# EasyEDA Pro project ProPrj_100MHz��ѹ���̽ͷ_2024-07-25.epro, board 高压差分探头_PLUS_V6
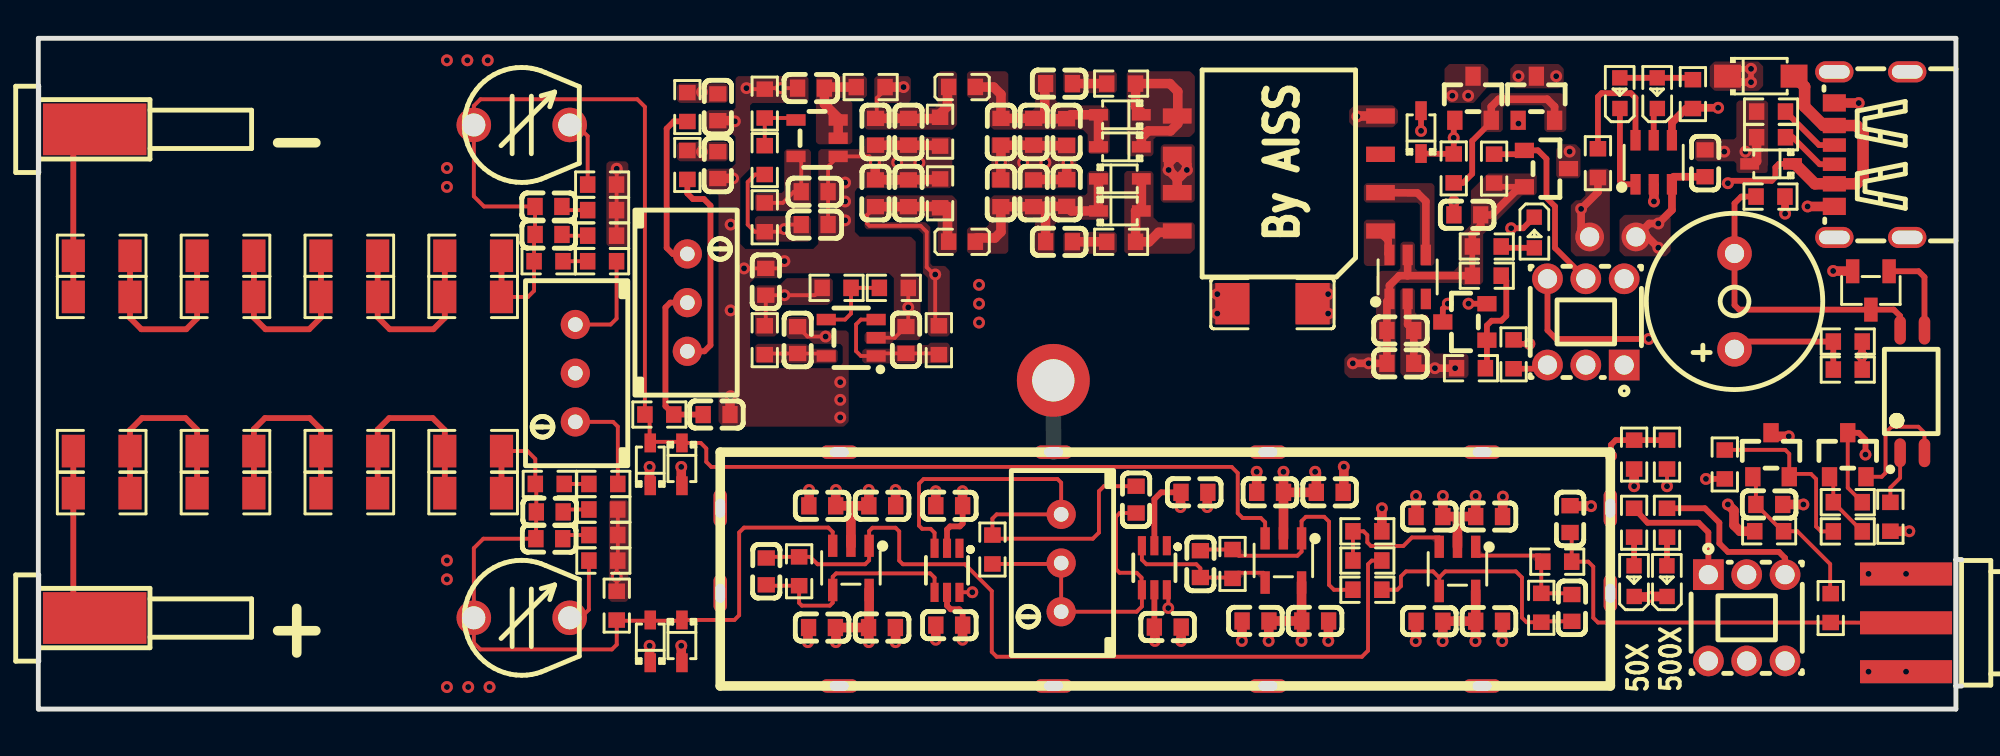
[diagram p6: board, top side]
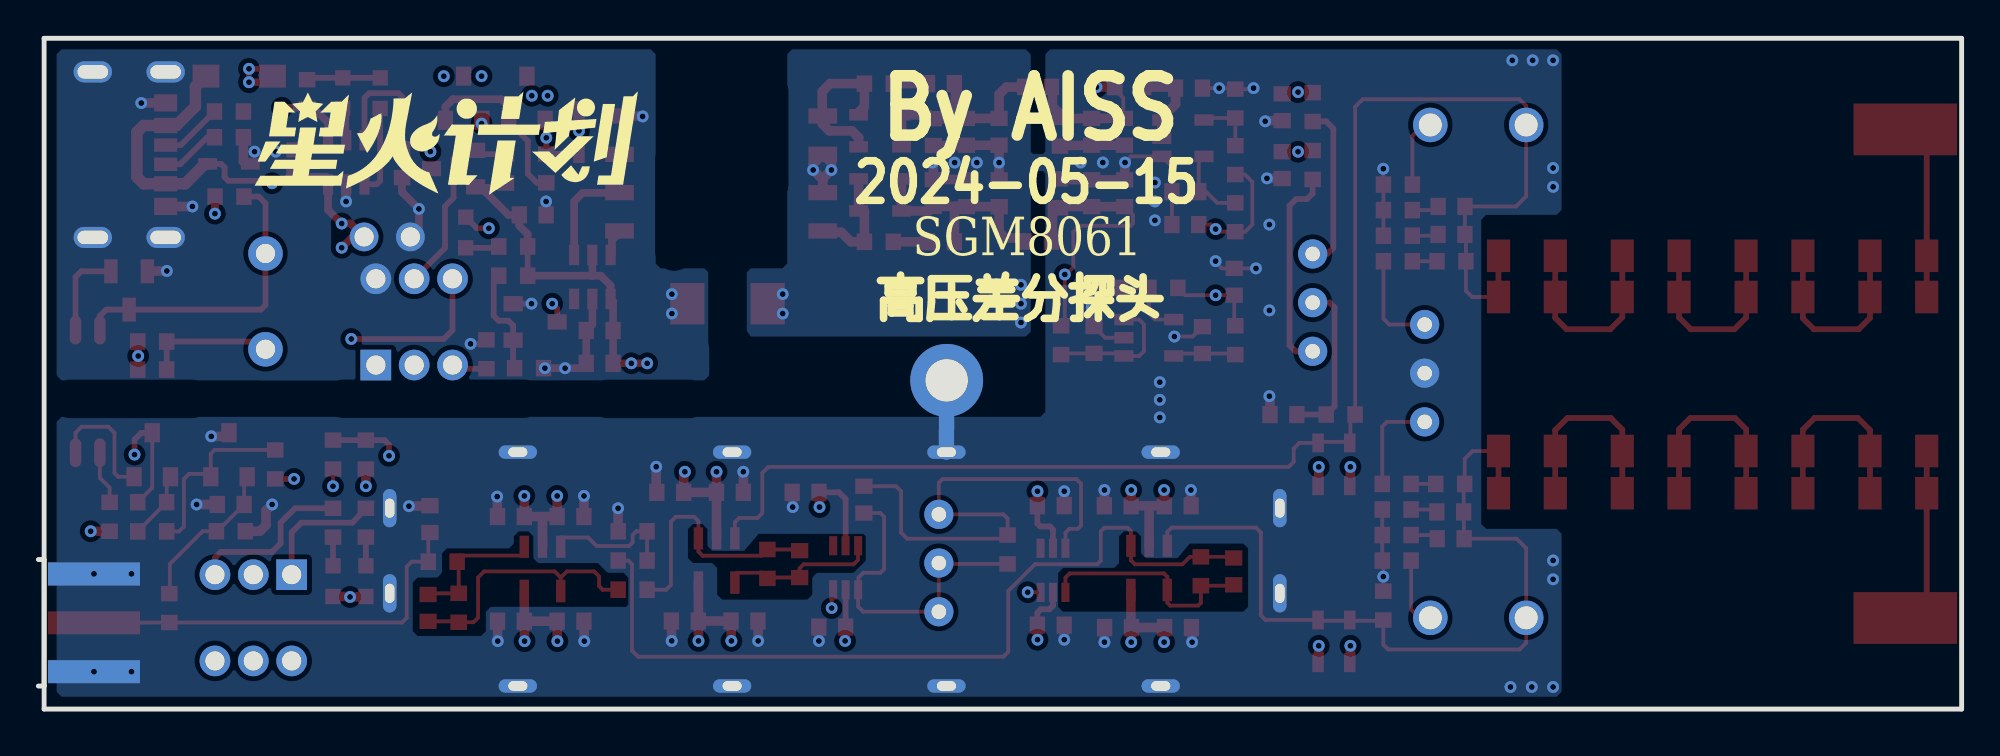
[diagram p7: board, bottom side, seen from below]

Outline 100.3 x 35 mm; copper layers: Top Layer, Inner1, Inner2, Bottom Layer. Coordinates in mm from the lower left corner of the outline.
Outline path: 0,35 100,35 100,0 0,0 0,35
Stack: Top Layer 0.035mm / Dielectric1 0.48mm PP er 4.5 / Inner1 0.035mm / Dielectric2 0.48mm FR4 er 4.5 / Inner2 0.035mm / Dielectric3 0.48mm PP er 4.5 / Bottom Layer 0.035mm

## Design rules (mm)
spacing Default (default): track to track 0.18, other pairs 0 to 0.18
track width Default (default): min 0.1, default 0.1, max 25.4
differential pair differentialPair (default): width min 0.127, default 0.254, max 2.54; gap min 0.152, default 0.152
via Default (default): diameter min 0.61, default 0.61, max 100.025; hole min 0.305, default 0.305, max 59.995

## Placement (name value [footprint] x y rotation side)
BUZZER  3kHz  [BUZ-TH_BD9.0-P5.00-D0.6-FD]  88.46 21.27 90 top
C1  22uF  [C0603]  51.9 26.92 270 top
C2  22uF  [C0603]  50.19 26.92 270 top
C3  1uF  [C0603]  44 4.25 180 top
C4  100nF  [C0603]  53.63 26.93 90 top
C5  22uF  [C0603]  43.66 30.12 90 top
C7  22uF  [C0603]  50.2 30.12 90 top
C8  22uF  [C0603]  51.91 30.12 90 top
C9  100nF  [C0603]  40.87 4.25 180 top
C10  10uF  [C0603]  45.25 19.26 270 top
C11  10uF  [C0603]  39.59 19.25 270 top
C12  10uF  [C0603]  37.94 22.3 270 top
C13  10uF  [C0603]  86.92 28.48 270 top
C14  1nF  [C0603]  53.23 24.38 180 top
C15  10uF  [C0603]  40.29 32.4 0 top
C16  10uF  [C0603]  40.48 27 180 top
C17  10uF  [C0603]  40.48 25.28 180 top
C18  100nF  [C0603]  53.62 30.11 270 top
C19  1nF  [C0603]  53.23 32.64 180 top
C20  10uF  [C0603]  71.03 18.04 180 top
C21  10uF  [C0603]  71.03 19.76 180 top
C22  100nF  [C0603]  35.43 31.4 270 top
C23  100nF  [C0603]  35.43 28.38 270 top
C24  2.2pF  [R1206]  3.3 21.51 180 top
C25  2.2pF  [R1206]  9.76 21.51 180 top
C26  2.2pF  [R1206]  16.22 21.51 180 top
C27  2.2pF  [R1206]  22.67 21.51 180 top
C28  10uF  [C0603]  74.52 25.79 0 top
C29  100nF  [C0603]  35.37 15.37 0 top
C30  68pF  [C0603]  26.61 24.77 180 top
C31  100pF  [C0603]  26.6 26.23 180 top
C32  120pF  [CAP-TH_JML06]  25.21 30.48 0 top
C33  820pF  [C0603]  37.96 7.18 270 top
C34  10pF  [C0603]  57.25 10.93 90 top
C35  2.2pF  [C0603]  79.97 5.28 270 top
C36  220pF  [C0603]  60.6 7.56 270 top
C37  68pF  [C0603]  26.67 10.29 0 top
C38  100pF  [C0603]  26.65 8.89 0 top
C39  120pF  [CAP-TH_JML06]  25.21 4.76 0 top
C40  2.2pF  [R1206]  3.3 13.46 180 top
C41  2.2pF  [R1206]  9.76 13.46 180 top
C42  2.2pF  [R1206]  16.22 13.46 180 top
C43  2.2pF  [R1206]  22.67 13.46 180 top
C44  NC  [C0603]  79.88 9.91 270 top
C45  2.2pF  [C0603]  90.27 10.68 0 top
C46  1uF  [C0603]  63.48 4.6 0 top
C47  1uF  [C0603]  72.55 4.58 0 top
C48  100nF  [C0603]  66.59 4.6 0 top
C49  100nF  [C0603]  75.66 4.58 0 top
C50  100nF  [C0603]  75.66 10.05 0 top
C51  100nF  [C0603]  67.35 11.31 0 top
C52  1uF  [C0603]  72.55 10.05 0 top
C53  1uF  [C0603]  64.24 11.31 0 top
C54  100nF  [C0603]  44.01 10.6 0 top
C55  1uF  [C0603]  40.88 10.6 0 top
C56  100nF  [C0603]  47.5 4.38 180 top
C57  100nF  [C0603]  47.5 10.61 180 top
C59  22uF  [C0603]  45.38 30.12 90 top
C60  22uF  [C0603]  43.65 26.92 270 top
C61  22uF  [C0603]  45.37 26.92 270 top
C62  100nF  [C0603]  58.9 4.28 0 top
C63  100nF  [C0603]  60.29 11.31 0 top
D1  PESD5V0S1BA  [SOD-323_L1.7-W1.3-LS2.5-FD-1]  90.36 28.45 0 top
D2  B0520LW  [SOD-123FL_L2.7-W1.8-LS3.8-RD]  89.82 33.03 0 top
D3  B5819WS  [SOD-323_L1.7-W1.3-LS2.5-FD-1]  56.4 27.66 180 top
D4  B5819WS  [SOD-323_L1.7-W1.3-LS2.5-FD-1]  56.4 25.99 180 top
D5  B5819WS  [SOD-323_L1.7-W1.3-LS2.5-FD-1]  72.11 30.11 270 top
D6  B5819WS  [SOD-323_L1.7-W1.3-LS2.5-FD-1]  56.4 31.01 0 top
D7  B5819WS  [SOD-323_L1.7-W1.3-LS2.5-FD-1]  56.4 29.34 0 top
D8  1N4148WS  [SOD-323_L1.7-W1.3-LS2.5-FD-1]  31.91 12.77 270 top
D9  1N4148WS  [SOD-323_L1.7-W1.3-LS2.5-FD-1]  33.56 12.77 90 top
D10  1N4148WS  [SOD-323_L1.7-W1.3-LS2.5-FD-1]  31.91 3.53 270 top
D11  1N4148WS  [SOD-323_L1.7-W1.3-LS2.5-FD-1]  33.56 3.53 90 top
L1  2KΩ  [L0603]  48.17 24.39 180 top
L2  2KΩ  [L0603]  48.17 32.47 180 top
LED1  BLUE  [LED0603-RD]  83.22 6.67 90 top
LED2  BLUE  [LED0603-RD]  84.93 6.67 90 top
NOREF  -  [Pad_e7178]  75.3 13.41 0 top
NOREF#2  -  [Pad_e6514]  41.77 13.41 0 top
NOREF#3  -  [Pad_e7016]  83.31 24.64 0 top
NOREF#4  -  [Pad_e7414]  64.12 1.21 0 top
NOREF#5  -  [Pad_e6889]  52.93 17.15 0 top
NOREF#6  -  [Pad_e6485]  41.77 1.21 0 top
NOREF#7  -  [Pad_e7073]  81.98 10.48 90 top
NOREF#8  -  [Pad_e6879]  52.94 13.41 0 top
NOREF#9  -  [Pad_e7151]  75.3 1.21 0 top
NOREF#10  -  [Pad_e6603]  35.56 6.04 90 top
NOREF#11  -  [Pad_e7037]  81.98 6.04 90 top
NOREF#12  -  [Pad_e6653]  35.56 10.48 90 top
NOREF#13  -  [Pad_e6880]  64.12 13.41 0 top
NOREF#14  -  [Pad_e7413]  52.94 1.21 0 top
NOREF#15  -  [Pad_e7015]  80.9 24.64 0 top
Q1  SS8050  [SOT-23_L2.9-W1.3-P1.90-LS2.4-BR]  74.39 20.2 0 top
Q2  AO3401A  [SOT-23_L2.9-W1.3-P1.90-LS2.4-BR]  74.82 31.87 270 top
Q3  AO3401A  [SOT-23_L2.9-W1.3-P1.90-LS2.4-BR]  78.12 31.87 270 top
Q4  SS8050  [SOT-23-3_L2.9-W1.3-P1.90-LS2.4-BR]  95.57 21.84 90 top
Q5  S8550  [SOT-23_L2.9-W1.3-P1.90-LS2.4-BR]  94.36 13.27 270 top
Q6  AO3401A  [SOT-23_L2.9-W1.3-P1.90-LS2.4-BR]  78.65 28.2 180 top
R1  1kΩ  [R0603]  75.54 24.14 0 top
R2  330Ω  [R0603]  47.02 26.91 270 top
R3  330Ω  [R0603]  47.02 30.13 90 top
R4  100kΩ  [R0603]  75.92 28.2 270 top
R5  47kΩ  [R0603]  76.93 18.51 270 top
R6  27kΩ  [R0603]  75.54 22.61 180 top
R10  5.1kΩ  [R0603]  90.36 31.18 0 top
R11  5.1kΩ  [R0603]  90.36 29.84 0 top
R12  4.7kΩ  [R0603]  74.71 17.79 0 top
R14  2.2Ω  [R0603]  46.96 19.25 270 top
R15  0Ω  [R0603]  37.88 19.25 90 top
R17  120kΩ  [R0603]  41.63 21.98 180 top
R18  110kΩ  [R0603]  44.61 21.98 0 top
R19  4.7kΩ  [R0603]  81.33 28.49 90 top
R20  100kΩ  [R0603]  73.81 28.21 90 top
R21  22Ω  [R0603]  56.47 24.38 180 top
R23  120kΩ  [R0603]  37.88 28.65 270 top
R24  110kΩ  [R0603]  37.88 31.59 90 top
R26  2.2Ω  [R0603]  43.41 32.46 180 top
R27  0Ω  [R0603]  37.88 25.66 270 top
R28  22Ω  [R0603]  56.47 32.64 180 top
R29  22Ω  [R0603]  33.85 31.41 270 top
R30  22Ω  [R0603]  33.85 28.39 90 top
R31  1KΩ  [RES-ADJ-TH_3296W]  33.85 21.21 0 top
R33  10kΩ  [R0603]  90.26 9.28 0 top
R34  330KΩ  [R0603]  32.38 15.37 0 top
R35  1MΩ  [R1206]  3.3 23.65 0 top
R36  1MΩ  [R1206]  9.76 23.65 0 top
R37  1MΩ  [R1206]  16.22 23.65 0 top
R38  1MΩ  [R1206]  22.67 23.65 0 top
R39  7.5kΩ  [R0603]  26.61 23.37 180 top
R40  402Ω  [R0603]  69.31 9.28 0 top
R41  402Ω  [R0603]  39.67 7.19 90 top
R42  470Ω  [R0603]  29.4 23.37 180 top
R43  10Ω  [R0603]  29.4 24.7 180 top
R44  10Ω  [R0603]  29.4 26.03 180 top
R45  10Ω  [R0603]  29.4 27.37 180 top
R46  402Ω  [R0603]  69.31 7.75 180 top
R47  49.9Ω  [R0603]  79.21 7.69 0 top
R48  200Ω  [RES-ADJ-TH_3296W]  28 17.53 180 top
R49  402Ω  [R0603]  69.31 6.23 0 top
R50  100Ω  [R0603]  49.75 8.33 270 top
R52  470Ω  [R0603]  29.46 11.75 0 top
R53  10Ω  [R0603]  29.46 10.41 0 top
R54  10Ω  [R0603]  29.46 9.08 0 top
R55  10Ω  [R0603]  29.46 7.75 0 top
R56  402Ω  [R0603]  62.28 7.57 90 top
R57  10KΩ  [RES-ADJ-TH_3296W]  53.34 7.62 180 top
R58  402Ω  [R0603]  78.38 5.29 90 top
R59  7.5kΩ  [R0603]  26.67 11.75 0 top
R60  NC  [R0603]  30.16 5.4 90 top
R62  1MΩ  [R1206]  3.3 11.27 0 top
R63  1MΩ  [R1206]  9.76 11.27 0 top
R64  1MΩ  [R1206]  16.22 11.27 0 top
R65  1MΩ  [R1206]  22.67 11.27 0 top
R67  2.2kΩ  [R0603]  90.33 26.74 0 top
R68  2.2kΩ  [R0603]  96.58 10.03 270 top
R69  1kΩ  [R0603]  87.95 12.76 270 top
R70  2.2kΩ  [R0603]  83.22 9.72 270 top
R71  1kΩ  [R0603]  94.36 9.27 180 top
R72  2.2kΩ  [R0603]  84.93 9.72 270 top
R73  2.2kΩ  [R0603]  84.93 13.28 270 top
R74  7.5kΩ  [R0603]  93.47 5.27 90 top
R75  2.2kΩ  [R0603]  83.22 13.28 90 top
R76  18kΩ  [R0603]  94.36 10.8 180 top
RF1  BWSMA-KE-P001  [SMA-SMD_BWSMA-KE-P001]  97.4 4.5 0 top
SW1  TK-6580-1  [SW-TH_TK-6580-1]  80.7 20.2 270 top
SW2  TK-6580-1  [SW-TH_TK-6580-1]  89.09 4.76 90 top
U2  BLUE  [LED0603-RD]  78.01 24.87 270 top
U5  1kΩ  [R0603]  86.28 32.09 90 top
U6  RED  [LED0603-RD]  82.47 32.14 90 top
U7  TP4057  [SOT-23-6_L2.9-W1.6-P0.95-LS2.8-BL]  84.24 28.53 0 top
U8  GREED  [LED0603-RD]  84.43 32.14 90 top
U9  ME6211C25M5G-N  [SOT-23-5_L3.0-W1.7-P0.95-LS2.8-BR]  42.39 19.38 0 top
U10  SGM2209-ADJXN5G/TR  [SOT-23-5_L2.9-W1.6-P0.95-LS2.8-BL]  40.61 29.79 90 top
U11  EPC10  [XFMR-SMD_8P-L10.8-W7.9-P2.00_EPC10]  64.69 27.95 0 top
U14  1nF  [C1808]  64.36 21.15 0 top
U15  SGM8061XN5/TR  [SOT-23-5_L3.0-W1.7-P0.95-LS2.8-BL]  42.38 7.37 180 top
U16  SGM8061XN5/TR  [SOT-23-5_L3.0-W1.7-P0.95-LS2.8-BL]  74.01 7.32 180 top
U17  SGM8061XN5/TR  [SOT-23-5_L3.0-W1.7-P0.95-LS2.8-BL]  64.93 7.75 180 top
U18  200Ω  [R0603]  94.36 19.18 0 top
U19  200Ω  [R0603]  94.36 17.72 0 top
U20  JC3H7C  [OPTO-SMD-4_L4.4-W2.7-P1.27-LS7.0-BR]  97.73 16.57 270 top
U21  BL1551B  [SC-70-6_L2.1-W1.3-P0.65-LS2.3-BR]  47.39 7.24 90 top
U22  TL432  [SOT-23_L2.9-W1.3-P1.90-LS2.4-BR]  90.36 13.27 270 top
U23  VPS8702  [SOT-23-6_L2.9-W1.6-P0.95-LS2.8-BL]  71.41 22.55 0 top
U24  2mm香蕉头  [2MM香蕉头母座]  4.97 30.25 0 top
U25  2mm香蕉头  [2MM香蕉头母座]  4.97 4.75 0 top
U26  BL1551B  [SC-70-6_L2.1-W1.3-P0.65-LS2.3-BR]  58.2 7.37 90 top
USBC1  USB 3.1 C 6PF  [USB-C-SMD_TYPE-C-USB-13]  95.56 28.93 90 top

## Footprints (pads in the part's own frame, mm; a bottom-side part is the same pattern mirrored in y, then rotated)
2MM香蕉头母座
  rect 5.4x2.7 smd: 1(-2.032,0)
BUZ-TH_BD9.0-P5.00-D0.6-FD
  round 1.8 hole 1: 1(-2.5,0) 2(2.5,0)
C0603
  rect 0.8x0.9 smd: 1(-0.7,0) 2(0.7,0)
C1808
  rect 1.785x2.16 smd: 1(-2.092,0) 2(2.092,0)
CAP-TH_JML06
  round 1.8 hole 1.2: 1(-2.5,0) 2(2.5,0)
L0603
  rect 0.8x0.864 smd: 1(-0.7,0) 2(0.7,0)
LED0603-RD
  rect 0.8x0.8 smd: 1(-0.799,-0.004) 2(0.799,0.004)
OPTO-SMD-4_L4.4-W2.7-P1.27-LS7.0-BR
  oval 1.5x0.6 smd: 1(3.2,-0.635) 2(3.2,0.635) 3(-3.2,0.635) 4(-3.2,-0.635)
Pad_e6485
  oval 2x0.7 hole 1x0.5: 2(0,0)
Pad_e6514
  oval 2x0.7 hole 1x0.5: 2(0,0)
Pad_e6603
  oval 2x0.7 hole 1x0.5: 2(0,0)
Pad_e6653
  oval 2x0.7 hole 1x0.5: 2(0,0)
Pad_e6879
  oval 2x0.7 hole 1x0.5: 2(0,0)
Pad_e6880
  oval 2x0.7 hole 1x0.5: 2(0,0)
Pad_e6889
  round 3.8 hole 2.2: 3(0,0)
Pad_e7015
  round 1.5 hole 1: 1(0,0)
Pad_e7016
  round 1.5 hole 1: 1(0,0)
Pad_e7037
  oval 2x0.7 hole 1x0.5: 2(0,0)
Pad_e7073
  oval 2x0.7 hole 1x0.5: 2(0,0)
Pad_e7151
  oval 2x0.7 hole 1x0.5: 2(0,0)
Pad_e7178
  oval 2x0.7 hole 1x0.5: 2(0,0)
Pad_e7413
  oval 2x0.7 hole 1x0.5: 2(0,0)
Pad_e7414
  oval 2x0.7 hole 1x0.5: 2(0,0)
R0603
  rect 0.806x0.864 smd: 1(-0.753,0) 2(0.753,0)
R1206
  rect 1.208x1.701 smd: 1(-1.479,0) 2(1.479,0)
RES-ADJ-TH_3296W
  round 1.524 hole 0.762: 1(0,2.54) 2(0,0) 3(0,-2.54)
SC-70-6_L2.1-W1.3-P0.65-LS2.3-BR
  rect 1x0.42 smd: 1(1.15,-0.65) 2(1.15,0) 3(1.15,0.65) 4(-1.15,0.65) 5(-1.15,0) 6(-1.15,-0.65)
SMA-SMD_BWSMA-KE-P001
  rect 4.8x1.2 smd: 1(0,-2.55) 2(0,2.55) 5(0,0)
  rect 4.8x1.2 smd far side: 3(0,2.55) 4(0,-2.55)
SOD-123FL_L2.7-W1.8-LS3.8-RD
  rect 1.4x1.2 smd: 1(-1.735,0) 2(1.735,0)
SOD-323_L1.7-W1.3-LS2.5-FD-1
  rect 0.985x0.6 smd: 1(-1.117,0) 2(1.117,0)
SOT-23-3_L2.9-W1.3-P1.90-LS2.4-BR
  rect 1.25x0.7 smd: 1(1,-0.95) 2(1,0.95) 3(-1,0)
SOT-23-5_L2.9-W1.6-P0.95-LS2.8-BL
  rect 0.6x1 smd: 1(-0.95,-1.1) 2(0,-1.1) 3(0.95,-1.1) 4(0.95,1.1) 5(-0.95,1.1)
SOT-23-5_L3.0-W1.7-P0.95-LS2.8-BL
  rect 0.49x1.157 smd: 1(-0.95,-1.153) 2(0,-1.153) 3(0.95,-1.153)
  rect 0.49x1.175 smd: 4(0.95,1.153) 5(-0.95,1.153)
SOT-23-5_L3.0-W1.7-P0.95-LS2.8-BR
  rect 1x0.6 smd: 1(1.3,-0.95) 2(1.3,0) 3(1.3,0.95) 4(-1.3,0.95) 5(-1.3,-0.95)
SOT-23-6_L2.9-W1.6-P0.95-LS2.8-BL
  rect 0.532x1.072 smd: 1(-0.95,-1.149) 2(0,-1.149) 3(0.95,-1.149) 4(0.95,1.149) 5(0,1.149) 6(-0.95,1.149)
SOT-23_L2.9-W1.3-P1.90-LS2.4-BR
  rect 1x0.8 smd: 1(1.15,-0.95) 2(1.15,0.95) 3(-1.15,0)
SW-TH_TK-6580-1
  rect 1.6x1.6 hole 1: 1(2.25,2)
  round 1.6 hole 1: 2(2.25,0) 3(2.25,-2) 4(-2.25,2) 5(-2.25,0) 6(-2.25,-2)
USB-C-SMD_TYPE-C-USB-13
  oval 1.1x2 hole 0.7x1.6: 1(-4.32,1.899) 2(-4.32,-1.901) 3(4.32,-1.901) 4(4.32,1.899)
  rect 0.7x1.2 smd: A5(-0.5,1.897) B5(0.5,1.897)
  rect 0.8x1.2 smd: A9(-1.52,1.899) B9(1.52,1.901)
  rect 0.9x1.2 smd: A12(-2.7,1.899) B12(2.7,1.899)
XFMR-SMD_8P-L10.8-W7.9-P2.00_EPC10
  rect 1.5x0.8 smd: 1(5.3,-3) 2(5.3,-1) 3(5.3,1) 4(5.3,3) 5(-5.3,3) 6(-5.3,1) 7(-5.3,-1) 8(-5.3,-3)

## Nets
As in the schematic, except:
GND: C1.1 C2.1 C3.1 C4.2 C5.1 C7.1 C8.1 C9.2 C10.1 C11.1 C12.1 C15.1 C16.1 C17.1 C18.2 C22.2 C23.2 C29.2 C44.1 C45.2 C46.1 C47.1 C48.2 C49.2 C50.2 C51.2 C52.1 C53.1 C54.2 C55.1 C56.2 C57.2 C59.1 C60.1 C61.1 C62.2 C63.2 NOREF.2 NOREF#2.2 NOREF#4.2 NOREF#5.3 NOREF#6.2 NOREF#7.2 NOREF#8.2 NOREF#9.2 NOREF#10.2 NOREF#11.2 NOREF#12.2 NOREF#13.2 NOREF#14.2 R2.1 R3.1 R18.2 R24.2 R33.1 R40.2 R43.1 R44.1 R45.1 R48.2 R53.2 R54.2 R55.2 R60.2 RF1.1 RF1.2 RF1.3 RF1.4 U9.2 U10.1 U11.6 U11.7 U14.1 U22.3
PGND: C13.1 C20.1 C21.1 C28.1 D1.1 NOREF#15.1 Q1.2 Q4.2 R5.1 R10.1 R11.1 R12.1 R19.1 SW1.4 U7.2 U11.4 U14.2 U23.2 USBC1.1 USBC1.2 USBC1.3 USBC1.4 USBC1.A12 USBC1.B12
BAT+: C13.2 NOREF#3.1 Q2.3 U7.3

Pads without a net: SW1 1; U11 3; U21 1; U23 3; U26 1

## Via types
v1: diameter 0.62, hole 0.31, Top Layer to Bottom Layer, 138 vias
v2: diameter 0.61, hole 0.305, Top Layer to Bottom Layer, 1 via

## Routing (per net, layer and track width the routed paths; a pad name or vN(x,y) marks a point on that pad's centre or on a via; arc(x,y) is an arc through that point)
+2.5V: length 125.8
  Top Layer w0.2: R17.2 40.49,21.6 v1(38.91,21.6) C12.2 37.94,20.06 37.88,20
  Top Layer w0.3: U26.5 58.2,4.28 ; U21.5 47.39,5.4 47.58,5.21 48.02,5.21 48.2,5.03 C56.1
  Top Layer w0.5: 74.94,3.55 74.96,4.58 73.25,4.58 73.23,3.55 ; v1(31.88,12.64) 31.88,11.71 ; U16.5 74.96,4.58 ; v1(31.88,3.3) 31.88,2.38 ; v1(58.23,3.56) 58.23,4.25 C62.1 ; v1(48.2,3.62) 48.2,4.38 C56.1 ; v1(65.87,3.56) 65.89,4.59 64.17,4.59 v1(64.16,3.56) ; v1(43.31,3.49) 43.31,4.24 ; v1(41.59,3.49) 41.59,4.23 C9.1 C3.2 ; U17.5 65.88,4.61 C48.1 ; U15.5 43.32,4.25
  Inner2 w0.5: v1(34.61,29.08) 36.94,29.08 37.63,28.39 37.63,22.87 v1(38.91,21.6) 38.85,15.58 37.94,14.68 32.61,14.68 31.91,13.98 31.91,12.67 v1(31.88,12.64) v1(31.88,3.3) 32.89,2.29 40.39,2.29 v1(41.59,3.49) v1(43.31,3.49) 44.32,2.48 47.06,2.48 v1(48.2,3.62) 49.34,2.48 57.15,2.48 v1(58.23,3.56) 59.31,2.48 63.08,2.48 v1(64.16,3.56) v1(65.87,3.56) 66.95,2.48 72.16,2.48 v1(73.23,3.55) v1(74.94,3.55) 75.98,2.51 SW2.4 SW2.5
+4.5V: length 87.2
  Top Layer w0.2: R14.1 46.77,20.19 v1(46.77,22.68) 46.71,22.68 46.33,23.06 46.33,24.9 46.01,25.22 43.34,25.22 43.22,25.34 43.22,25.78 43.66,26.22
  Top Layer w0.3: 87.95,12.01 86.97,12.01
  Top Layer w0.5: C60.2 C61.2 47.41,26.23 47.41,24.58 ; 97.57,9.28 96.58,9.28
  Inner2 w0.3: 46.77,22.68 46.77,14.87 47.48,14.16 86.47,14.16 86.97,13.66 86.97,12.01 88.68,12.01 89.06,11.63 89.06,7.04 SW2.2 90.44,5.66 97.7,5.66 98.2,6.16 98.2,8.65 97.57,9.28
  vias: v1(86.97,12.01) v1(97.57,9.28)
+5V: length 64.9
  Top Layer w0.3: R4.2 76.11,27.25 Q6.2 ; v1(83.98,19.31) 79.16,19.31 78.7,19.77 78.7,22.45 ; 88.09,33.03 88.47,33.41 v1(89.32,33.41) v1(89.32,32.71) ; R1.1 R6.2
  Top Layer w0.4: 77.56,27.25 77.25,27.25 75.78,25.78 75.22,25.78 ; v1(91.09,25.85) R67.2 ; 95.12,17.72 95.09,18.42 95.12,19.18 ; v1(89.32,32.71) 88.41,32.71 88.09,33.03 ; 74.78,24.14 74.78,24.78 75.22,25.22 75.22,25.78 ; R6.2 71.41,22.61 ; 71.41,22.61 70.97,22.61 70.46,22.1 70.46,21.4 ; 71.41,22.61 U23.5 ; 75.22,25.78 C28.2 ; v1(68.55,18.04) v1(69.38,18.04) C20.2 C21.2 70.33,21.27 U23.1
  Inner2 w0.3: 95.09,18.42 90.97,18.42 90.01,17.47 85.82,17.47 v1(83.98,19.31)
  Inner2 w0.5: v1(89.32,32.71) 90.59,32.71 91.09,32.2 v1(91.09,25.85) 91.09,20.65 91.67,20.07 94.65,20.07 95.09,19.63 95.09,18.42
  vias: v1(77.19,33.03) v1(79.16,33.02) v1(95.09,18.42)
+VCC: length 12.2
  Top Layer w0.5: C2.2 C1.2 ; 52.59,24.31 C14.2 52.53,26.22 51.9,26.22 51.91,26.23 C4.1 53.87,25.99 D4.2 55.29,27.67 ; 48.92,24.58 49.88,24.58 50.2,24.9 50.19,26.22
-2.5V: length 134.6
  Top Layer w0.2: C17.2 39.15,25.28 38.78,24.91 37.88,24.91 ; 37.88,27.89 37.38,27.89 36.99,27.5 36.99,25.28 37.36,24.91 R27.2
  Top Layer w0.3: C63.1 58.55,11.31 58.2,10.96 U26.2 ; U21.2 47.39,9.37 47.55,9.53 48.06,9.53 48.2,9.68 48.2,10.22
  Top Layer w0.5: 42.38,10.6 C54.1 43.31,11.43 v1(43.31,11.43) ; 42.38,10.6 U15.2 ; 42.38,10.6 C55.2 41.58,11.42 v1(41.59,11.43) ; v1(33.53,12.64) 33.53,11.71 ; v1(48.2,11.37) 48.2,10.56 48.2,10.55 ; 83.22,12.52 v1(83.22,11.63) ; C53.2 64.94,8.92 ; C53.2 66.65,11.31 66.65,12.32 v1(66.58,12.38) ; C53.2 v1(64.93,12.38) ; v1(73.24,11.12) 73.25,10.05 73.94,10.05 74.01,9.98 ; v1(74.96,11.12) 74.96,10.05 74.07,10.05 74.01,9.98 ; v1(59.56,10.54) 59.56,11.28 C63.1 ; 74.01,8.47 74.01,9.98 ; v1(33.53,3.3) 33.53,2.38
  Inner2 w0.5: v1(34.61,32.19) 35.3,31.5 38.26,31.5 38.92,30.85 38.92,25.05 39.85,24.11 39.85,15.06 38.45,13.66 34.07,13.66 33.53,13.12 v1(33.53,12.64) v1(33.53,3.3) 36.03,3.3 36.55,3.82 36.55,11.75 37.12,12.33 40.7,12.33 v1(41.59,11.43) 43.2,11.43 44.16,12.39 47.17,12.39 v1(48.2,11.37) 49.21,12.38 57.72,12.38 v1(59.56,10.54) 60.39,11.37 63.88,11.37 64.9,12.38 v1(64.93,12.38) v1(66.58,12.38) 67.09,11.87 72.49,11.87 v1(73.25,11.12) v1(74.96,11.12) 74.96,11.15 75.82,12.01 82.84,12.01 v1(83.22,11.63)
  vias: v1(38.91,25.05)
-4.5V: length 109.4
  Top Layer w0.2: Q5.3 94.36,11.55 R76.1 ; R26.1 44.16,32.32 43.72,31.88 43.72,30.82 43.66,30.82
  Top Layer w0.3: Q5.3 94.37,14.41 94.93,14.41 95.28,14.06 v1(95.28,13.28)
  Top Layer w0.5: LED1.1 83.25,5.85 84.05,5.85 84.07,5.88 LED2.1 ; C59.2 C5.2 ; 47.41,32.46 47.41,31.44 47.09,31.12 47.09,30.81 45.38,30.82 ; R26.1 v1(45.12,32.46)
  Inner2 w0.3: 84.05,5.85 84.81,5.09 97.89,5.09 98.78,5.98 98.78,12.77 98.27,13.28 89.32,13.28 87.91,14.69 47.97,14.69 47.47,15.18 47.47,31.95 46.96,32.46 v1(45.12,32.46)
  vias: v1(84.04,5.85)
-VCC: length 11.8
  Top Layer w0.5: C8.2 C7.2 50.2,32.08 49.82,32.46 48.92,32.46 ; 51.91,30.8 53.62,30.8 53.83,31.01 D6.1 D7.1 ; 52.53,32.64 52.49,32.6 52.49,31.12 52.18,30.82 51.91,30.82
GND: length 78.7
  Top Layer w0.2: R53.2 R54.2 R55.2 30.16,7.69 v1(30.16,6.91) R60.2 ; v1(41.06,19.44) 40.11,19.44 C11.1 ; 36.8,22.99 C12.1 38.58,23 38.96,23.38 ; C17.1 C16.1 41.18,28.31 41.71,28.84 43.34,28.84 43.34,28.81 v1(43.63,28.52) ; 36.93,32.4 36.98,32.35 37.88,32.35 37.93,32.4 v1(38.72,32.4) C15.1 ; 30.16,24.7 30.16,27.37 30.16,27.38 v1(30.16,28.19) ; U9.2 44.66,19.38 C10.1 45.37,20.08 v1(45.37,20.96) 45.37,21.98
  Top Layer w0.5: v1(60.96,10.54) 60.96,11.28 C63.2 60.99,11.31 ; v1(61.48,20.64) 62.25,20.64 62.77,21.15 62.27,21.65 v1(61.48,21.65) ; 79.94,10.6 v1(80.97,10.59) ; 71.85,10.05 71.84,10.05 v1(71.84,11.12) ; C8.1 C7.1 v1(50.2,28.52) 50.19,27.61 ; v1(62.76,3.56) 62.77,4.59 ; v1(46.8,3.62) 46.8,4.38 ; C5.1 C59.1 ; C22.2 36.29,30.7 v1(36.32,30.67) ; 88.11,10.68 88.43,10.36 88.43,9.6 88.75,9.28 R33.1 ; 59.39,27.63 v1(59.9,28.13) 59.9,28.44 U11.6 58.94,28.5 v1(58.94,28.13) 59.39,27.68 59.39,27.63 ; 59.39,27.63 U11.7 ; 51.9,27.62 51.91,27.63 C4.2 53.63,28.47 53.67,28.51 ; v1(63.54,12.38) 63.53,11.31 ; 47.09,27.63 45.37,27.62 ; C61.1 C60.1 ; 90.36,14.27 90.4,14.23 v1(91.28,14.23) ; 71.84,4.58 71.83,3.55 ; 36.1,16.33 36.07,16.29 C29.2 ; 44.7,11.37 44.7,10.61 44.71,10.6 ; v1(70.07,10.48) 70.07,9.28 R40.2 ; C50.2 76.37,11.08 ; v1(40.13,3.49) 40.13,4.22 40.17,4.25 ; 68.05,11.31 68.08,11.31 v1(68.08,12.64) ; 51.91,29.4 53.62,29.4 ; C3.1 44.7,4.25 v1(44.7,3.49) ; 45.38,29.42 47.09,29.41 ; C23.2 35.44,27.69 v1(36.23,27.69) ; v1(67.27,3.56) C48.2 ; 76.36,4.58 76.34,3.55 ; v1(46.8,11.37) 46.8,10.55 ; v1(40.2,11.43) 40.2,10.62 ; v1(43.63,28.52) 43.65,27.62 ; C45.2 v1(92.05,10.68) ; v1(59.59,3.55) 59.59,4.27
  Inner1 w0.8: NOREF#8.2 52.93,17.15
  Bottom Layer w0.8: 52.93,17.15 NOREF#8.2
  vias: v1(21.31,33.85) v1(21.31,28.23) v1(21.31,27.25) v1(21.31,7.75) v1(21.31,6.77) v1(21.31,1.15) v1(22.37,33.85) v1(22.42,1.15) v1(23.43,33.85) v1(23.53,1.15) v1(36.1,25.28) v1(36.1,20.8) v1(36.1,16.33) v1(36.8,22.99) v1(36.93,32.4) v1(38.91,23.38) v1(41.82,17.06) v1(41.82,16.14) v1(41.82,15.22) v1(42.07,27.47) v1(42.07,26.49) v1(42.07,25.5) v1(44.7,11.43) v1(44.79,28.52) v1(45.94,28.52) v1(49.06,22.14) v1(49.06,21.15) v1(49.06,20.17) v1(51.36,28.52) v1(52.52,28.52) v1(53.67,28.52) v1(71.83,3.55) v1(76.34,3.55) v1(76.37,11.09) v1(88.11,10.68) v1(95.44,7.06) v1(95.44,1.95) v1(97.4,7.06) v1(97.4,1.95)
PGND: length 22.6
  Top Layer w0.3: v1(77.76,19.06) 77.14,19.06 76.93,19.27 ; v1(74.58,21.15) 74.59,21.15 Q1.2
  Top Layer w0.4: 81.33,27.73 81.33,26.97 v1(80.45,26.1) 80.45,25.08 NOREF#15.1 ; 73.95,17.79 v1(72.83,17.79) 71.98,17.79 C20.1 C21.1 71.41,20.08 U23.2
  Top Layer w0.5: 73.95,17.79 73.96,17.79 ; U7.2 84.25,27.37 v1(84.25,26.49) ; 89.61,29.84 89.61,28.58 89.47,28.45 D1.1 ; v1(67.26,20.64) 66.47,20.64 65.95,21.15 66.45,21.65 v1(67.26,21.65) ; 94.62,22.84 v1(93.6,22.86) ; 69.99,30.95 68.81,30.95 v1(68.79,30.92) ; v1(73.82,26.49) 73.82,25.79 ; v1(94.93,31.62) USBC1.B12 ; v1(92.27,26.23) 93.66,26.23 USBC1.A12
  vias: v1(73.88,17.79) v1(87.92,29.09) v1(89.03,29.09)
VBUS: length 53
  Top Layer w0.3: D1.2 90.77,28.45 90.59,28.27 90.59,27.76 90.4,27.57 88.24,27.57 88.11,27.44 ; v1(72.11,30.17) D5.1
  Top Layer w0.6: 93.66,27.41 92.65,27.41 91.61,28.45 D1.2 ; 93.66,27.41 94.81,27.41 95.16,27.76 95.16,30.11 94.82,30.45 93.1,30.45 92.11,31.44 92.11,32.48 D2.2
  Inner2 w0.3: 88.11,27.44 89.38,27.44 90.01,26.8 90.01,20.77 89.57,20.33 72.62,20.33 72.11,20.84 v1(72.11,30.17)
  vias: v1(88.11,27.44)
BAT+: length 7.3
  Top Layer w0.4: C13.2 85.29,27.78 85.19,27.68 85.19,27.38 ; U7.3 85.19,26.05 v1(84.48,25.34) 84.01,25.34 NOREF#3.1 83.92,24.64 v1(84.48,24.07)
  vias: v1(73.74,32) v1(74.56,32)
BAT_CHRG: length 32.2
  Top Layer w0.4: 87.3,31.38 86.33,31.38 U5.1 85.93,31.34 85.19,30.6 85.19,29.68
  Inner2 w0.6: 87.6,31.38 86.71,30.49 86.71,21.66 86.14,21.09 77.57,21.09 77,21.66 77,23.31 78.78,25.09 78.78,28.01 79.85,29.09
  vias: v1(79.85,29.09) v1(87.6,31.38)
HV_IN+: length 42.3
  Top Layer w0.2: 24.15,13.46 25.51,13.46 25.92,13.05 R59.1 25.97,11.69 25.97,10.29 C38.1 23.21,8.89 22.71,8.39 C39.1 22.71,3.45 23.05,3.11 29.91,3.11 30.16,3.37 R60.1 30.2,4.61 33.53,4.61 ; U15.3 41.43,9.24 41.2,9.47 36.8,9.47 36.55,9.22 36.55,4.9 36.3,4.65 33.56,4.65
  Top Layer w0.3: 24.15,11.27 24.15,13.46
HV_IN-: length 79.6
  Top Layer w0.2: 24.15,21.51 25.53,21.51 25.85,21.83 R39.2 25.85,24.71 C30.2 25.9,26.23 23.24,26.23 22.71,26.76 C32.1 22.71,31.47 23.06,31.82 31.23,31.82 31.63,31.42 31.63,15.37 31.88,15.12 31.88,13.94 33.53,13.94 ; 33.56,13.89 34.54,13.89 34.83,13.6 34.83,12.9 35.09,12.64 62.23,12.64 62.55,12.32 62.55,10.22 62.8,9.97 63.75,9.97 63.98,9.75 U17.3
  Top Layer w0.3: R38.2 24.15,21.51
SET_EN: length 50.9
  Top Layer w0.2: v1(48.7,6.1) 48.04,6.1 48.04,6.09 ; v2(58.93,5.27) 58.93,6.15 U26.6
  Top Layer w0.3: 84.94,14.03 82.26,14.03 82.01,13.79 82.01,13.22
  Inner2 w0.2: 82.01,13.22 83.6,13.22 84.05,12.77 84.05,10.68 82.52,9.15 81.51,9.15 80.88,9.78 68.33,9.78 67.94,9.4 67.94,5.59 67.63,5.27 v2(58.93,5.27) 58.93,6.03 58.61,6.35 48.96,6.35 v1(48.7,6.1)
  vias: v1(82.01,13.22)
SIGNAL_A: length 12.1
  Top Layer w0.2: U21.4 46.74,6.86 46.51,7.08 41.6,7.08 41.43,6.9 41.43,6.21 ; C33.2 38.01,6.44 R41.1 39.67,5.54 39.81,5.4 41.28,5.4 41.43,5.55 U15.4
SIGNAL_B: length 27.7
  Top Layer w0.2: U21.3 46.74,9.2 46.53,9.41 46.09,9.41 45.93,9.57 45.93,11.76 46.16,12 53.15,12 53.34,11.81 R57.3 49.97,10.16 49.75,9.94 R50.1 49.94,8.89 54.99,8.89 55.31,9.21 55.31,11.37 55.57,11.63 C34.2
SIGNAL_C: length 17.4
  Top Layer w0.2: R50.2 53.29,7.57 R57.2 R57.1 57.28,5.08 57.55,5.35 U26.4 57.53,6.24 57.53,6.86 57.28,7.11 56.39,7.11 56.2,7.3 56.2,10.03 56.39,10.23 C34.1
SIGNAL_D: length 8.4
  Top Layer w0.2: U17.4 63.98,7.02 63.88,7.11 62.57,7.11 R56.1 62.23,6.86 C36.2 60.6,7.35 60.39,7.56 57.78,7.56 57.55,7.79 U26.3
SIGNAL_OUT: length 21.9
  Top Layer w0.2: RF1.5 R74.1 81.34,4.52 81.09,4.76 81.09,7.43 80.83,7.69 R47.2 79.96,9.13 C44.2
$1N9: length 3.3
  Top Layer w0.3: 91.12,31.18 92.86,29.43 93.66,29.43
$1N10: length 3.1
  Top Layer w0.3: 91.12,29.84 91.49,29.84 92.9,28.43 93.66,28.43
$1N17: length 8.5
  Top Layer w0.5: R28.1 57.22,31.44 57.52,31.14 57.52,31.01 ; 57.52,29.34 57.52,29.82 57.87,30.17 59.04,30.17 59.42,30.55 59.42,32.22 59.01,32.64 57.22,32.64
$1N18: length 1.7
  Top Layer w0.5: 55.71,24.38 54.06,24.38 53.99,24.31
$1N19: length 1.6
  Top Layer w0.5: 53.93,32.64 55.52,32.64
$1N29: length 7.1
  Top Layer w0.3: 83.29,29.68 83.29,31.89 83.05,32.14 81.52,32.14 81.33,31.95 81.33,29.24
$1N31: length 4.7
  Top Layer w0.3: 83.29,27.38 82.66,27.38 82.48,27.56 82.48,31.34
$1N32: length 1.7
  Top Layer w0.3: U7.5 84.24,31.15 84.43,31.34
$1N34: length 3.9
  Top Layer w0.3: U5.2 86.28,32.94 U8.2 U6.2
$1N35: length 9.4
  Top Layer w0.3: 73.81,27.46 74.3,27.46 74.78,27.93 74.78,29.64 75.77,30.64 Q2.2
  Top Layer w0.4: Q3.2 79.07,31.44 78.69,31.82 76.16,31.82 75.77,31.43 Q2.2
$1N37: length 6
  Top Layer w0.5: 59.42,24.88 58.42,24.88 57.93,24.38 57.22,24.38 57.22,25.99 57.52,25.99 57.52,27.66
$1N38: length 9.4
  Top Layer w0.3: U2.1 77.43,25.09 v1(76.81,25.09) ; Q1.3 73.24,20.89 v1(73.5,21.15)
  Inner2 w0.3: v1(76.81,25.09) 74.01,25.09 73.5,24.58 v1(73.5,21.15)
$1N39: length 5.7
  Top Layer w0.3: 76.29,22.61 76.55,22.35 76.55,20.52 76.3,20.26 75.79,20.26 75.54,20.02 75.54,19.25 ; R12.2 75.54,17.87 Q1.1
$1N42: length 1.8
  Top Layer w0.3: R1.2 76.36,24.07 U2.2
$1N44: length 32
  Top Layer w0.3: D5.2 73.81,28.97 ; R20.2 v1(73.81,29.81) 73.81,30.67 Q2.1
  Inner2 w0.3: v1(77.19,30.55) 77.19,30.11 76.89,29.81 73.04,29.81 72.81,30.04 72.81,30.61 72.43,31 71.79,31 71.41,30.61 71.41,20.64 72.3,19.76 80.24,19.76 80.7,19.29 SW1.2
$1N50: length 5.3
  Top Layer w0.4: 69.99,26.95 71.92,26.93 72.36,26.49 72.36,23.7
$1N51: length 1.4
  Top Layer w0.4: 69.99,24.95 69.99,24.85 70.39,24.45 70.39,23.77 U23.6
$1N66: length 7
  Top Layer w0.2: 43.69,18.42 42.9,18.42 42.64,18.68 42.64,20.07 42.9,20.33 43.69,20.33 ; 46.96,18.5 46.9,18.56 C10.2 43.82,18.56 U9.1
$1N70: length 3.3
  Top Layer w0.2: 37.88,18.5 37.94,18.55 C11.2 40.96,18.55 U9.5
$1N78: length 4.6
  Top Layer w0.5: 41.71,29.79 41.71,30.85 40.99,31.57 C15.2 41.05,32.46 R26.2
$1N80: length 4.1
  Top Layer w0.2: 37.88,26.42 38.82,26.42 39.4,27 C16.2 39.78,28.57 U10.5
$1N84: length 4.2
  Top Layer w0.2: 43.86,21.98 42.38,21.98 42.38,20.64 42.07,20.33 41.09,20.33
$1N85: length 3.1
  Top Layer w0.2: R23.1 37.88,30.84 39.41,30.84 U10.4
$1N87: length 1.8
  Top Layer w0.3: 76.93,17.76 78.51,17.76 SW1.3
$1N88: length 10.1
  Top Layer w0.3: R4.1 77.3,28.95 Q6.1 78.2,29.15 78.65,28.71 78.65,26.68 79.09,26.23 79.09,24.06 80.7,22.45
$2N9: length 7.4
  Top Layer w0.2: 74.96,8.47 74.96,8.14 75.08,8.01 78.32,8.01 R47.1 78.38,7.61 R58.2 79.91,6.04 79.97,5.98
$2N10: length 13.5
  Top Layer w0.2: R56.2 62.6,8 65.66,8 65.88,8.22 U17.1 65.88,9.81 66.1,10.03 67.06,10.03 67.31,9.78 67.31,6.48 67.56,6.22 68.55,6.22 R49.1 ; 62.18,8.33 60.46,8.33 60.4,8.38
$2N11: length 44.2
  Top Layer w0.2: R46.1 70.06,7.75 69.53,7.75 69.34,7.56 69.34,3.05 69.02,2.73 49.97,2.73 49.72,2.98 49.72,6.16 48.32,7.56 45.09,7.56 44.89,7.75 44.89,9.27 44.7,9.46 43.5,9.46 43.32,9.29 U15.1 43.32,7.77 43.12,7.56 40.63,7.56 40.25,7.94 R41.2 38.02,7.94 C33.1
$2N13: length 7.2
  Top Layer w0.2: R46.2 R40.1 69.11,9.28 69.31,9.08 69.31,8.7 69.5,8.51 71.18,8.51 71.63,8.95 73.06,8.95 73.06,8.47
$2N15: length 13.9
  Top Layer w0.2: 73.06,6.86 73.06,6.87 73.37,7.18 77.05,7.18 77.37,6.87 77.37,4.77 77.61,4.53 R58.1 78.42,4.58 79.97,4.58 ; 73.06,6.86 U16.4 ; 73.06,6.86 72.74,7.18 71.32,7.18 71.06,6.92 71.06,6.41 70.87,6.23 70.06,6.23
$2N33: length 10.8
  Top Layer w0.3: R30.1 33.85,26.9 34.13,26.61 34.71,26.61 35.05,26.27 35.05,18.99 34.73,18.67 R31.3
$2N35: length 8.5
  Top Layer w0.3: 34.67,15.37 33.14,15.37 32.7,15.81 32.7,20.95 32.96,21.21 R31.2
$2N36: length 8.7
  Top Layer w0.3: R29.2 33.15,30.67 32.77,30.29 32.77,24.07 33.08,23.75 33.85,23.75
$2N40: length 3.7
  Top Layer w0.2: R45.2 28.65,29.9 28.07,30.48 27.71,30.48
$2N44: length 9.1
  Top Layer w0.3: 1.82,21.51 R35.1 1.82,29.44 2.64,30.25
$2N45: length 9
  Top Layer w0.3: 2.64,4.75 1.82,5.56 R62.1 1.82,13.46
$2N46: length 1.3
  Top Layer w0.2: R59.2 R52.1
$2N47: length 5.3
  Top Layer w0.2: R52.2 30.22,14.74 29.97,14.99 R48.1
$2N48: length 10.6
  Top Layer w0.3: C41.2 8.28,14.58 7.68,15.18 5.41,15.18 4.78,14.56 C40.1 ; R62.2 4.78,13.46 ; R63.1 8.28,13.46
$2N50: length 10.7
  Top Layer w0.3: 14.74,11.27 14.74,13.46 ; C42.2 14.74,14.6 14.15,15.18 11.82,15.18 11.24,14.61 11.24,13.46 ; 11.24,11.27 11.24,13.46
$2N51: length 10.6
  Top Layer w0.3: C43.2 21.2,14.55 20.57,15.18 18.3,15.18 17.7,14.58 C42.1 ; R64.2 17.7,13.46 ; R65.1 21.2,13.46
$2N55: length 5.3
  Top Layer w0.2: R48.3 29.84,20.07 30.16,20.38 30.16,23.37
$2N56: length 1.3
  Top Layer w0.2: R39.1 R42.2
$2N57: length 10.4
  Top Layer w0.3: C27.2 21.2,20.41 20.6,19.82 18.32,19.82 17.7,20.45 C26.1 ; R38.1 21.2,21.51 ; R37.2 17.7,21.51
$2N58: length 10.4
  Top Layer w0.3: 14.74,21.51 14.74,20.43 14.12,19.82 11.85,19.82 11.24,20.43 11.24,21.51 ; 11.24,23.65 11.24,21.51 ; 14.74,23.65 14.74,21.51
$2N60: length 10.5
  Top Layer w0.3: R35.2 4.78,21.51 ; C24.1 4.78,20.41 5.37,19.82 7.71,19.82 8.28,20.39 C25.2 ; R36.1 8.28,21.51
$2N70: length 17.8
  Top Layer w0.2: 84.94,12.52 84.94,11.63
  Inner2 w0.3: 84.94,11.63 84.94,10.68 83.28,9.02 83.28,5.28 84.11,4.45 90.65,4.45 91.09,4.01 SW2.6
  vias: v1(84.93,11.63)
$2N71: length 6.6
  Top Layer w0.3: 87.09,7.01 87.09,9.22 86.59,9.72 83.92,9.72 83.22,10.48
$2N72: length 8.7
  Top Layer w0.3: SW2.3 91.09,7.88 90.78,8.2 88.11,8.2 87.67,8.64 87.67,9.72 86.91,10.48 84.94,10.48
$2N74: length 1.5
  Top Layer w0.3: 83.22,7.47 83.22,8.97
$2N75: length 1.5
  Top Layer w0.3: 84.93,7.47 84.94,8.97
$2N78: length 8.4
  Top Layer w0.2: R74.2 93.44,6.05 93.44,7.56 91.73,9.28 90.97,9.28 89.57,10.68 89.57,12.11 89.41,12.27
$2N83: length 9.5
  Top Layer w0.2: 87.95,13.53 91.1,13.53 91.31,13.32 91.31,12.27 92.44,12.27 92.71,12 92.71,9.53 92.96,9.27 93.61,9.27
$2N86: length 2.8
  Top Layer w0.2: 96.58,10.79 96.58,11.56 97.09,12.06 97.09,13.37
$2N88: length 3.7
  Top Layer w0.2: 95.12,9.27 93.61,10.8 93.61,12.08 93.41,12.27
$2N90: length 4.7
  Top Layer w0.3: 96.52,22.84 98.06,22.84 98.36,22.54 U20.3
$2N92: length 6.8
  Top Layer w0.3: BUZZER.1 88.86,19.18 93.61,19.18 93.61,17.72
$2N93: length 16.2
  Top Layer w0.3: U20.4 97.09,20.51 96.76,20.84 Q4.3 88.69,20.84 88.46,21.08 BUZZER.2 88.46,26.39 88.81,26.74 R67.1
$2N95: length 1.4
  Top Layer w0.2: C31.1 27.49,26.03 R44.2
$2N96: length 1.4
  Top Layer w0.2: R53.1 27.5,10.41 27.37,10.29
$2N97: length 1.4
  Top Layer w0.2: 27.31,24.77 27.37,24.7 R43.2
$2N98: length 1.4
  Top Layer w0.2: C38.2 27.54,9.08 R54.1
$2N127: length 3.7
  Top Layer w0.2: R55.1 28.71,5.19 28.29,4.76 27.71,4.76
$2N12584: length 6.5
  Top Layer w0.2: U20.2 98.36,14.41 98.04,14.73 96.65,14.73 96.33,14.41 96.33,12.32 96.13,12.12 Q5.2

## Copper pours and planes (outline as drawn; the poured copper is in the pictures)
+2.5V on Top Layer: 33.44,29.6 33.31,29.47 33.31,28.71 33.44,28.58 35.85,28.58 35.98,28.71 35.98,29.47 35.85,29.6
+2.5V on Top Layer: 37.5,22.11 37.37,21.98 37.37,19.57 37.5,19.44 38.39,19.44 38.52,19.57 38.52,20.84 38.77,21.09 41.18,21.09 41.44,21.34 41.44,22.36 41.31,22.49 39.02,22.49 38.64,22.11
+4.5V on Top Layer: 46.52,19.44 46.39,19.57 46.39,22.49 46.14,22.74 46.14,24.77 45.88,25.03 43.21,25.03 43.09,25.15 43.09,26.68 43.21,26.8 47.66,26.8 47.91,26.55 47.91,23.88 47.79,23.76 47.02,23.76 46.9,23.88 46.9,25.41 46.64,25.66 43.34,25.66 43.34,25.41 46.26,25.41 46.52,25.15 46.52,23.25 46.64,23.12 47.28,23.12 47.53,22.87 47.53,19.57 47.41,19.44
+5V on Top Layer: 77.01,33.66 76.76,33.41 76.76,32.65 77.01,32.39 79.3,32.39 79.55,32.65 79.55,33.41 79.3,33.66
+5V on Top Layer: 68.36,17.28 68.11,17.53 68.11,18.3 68.36,18.55 69.5,18.55 69.76,18.8 69.76,22.61 70.01,22.87 70.9,22.87 71.03,22.99 71.03,24.26 71.15,24.39 71.66,24.39 71.79,24.26 71.79,22.99 71.92,22.87 73.82,22.87 74.08,23.12 74.08,24.65 74.71,25.28 74.71,27.06 75.6,27.95 78.01,27.95 78.14,27.82 78.14,26.93 78.01,26.8 77.38,26.8 75.35,24.77 75.35,22.3 75.16,22.11 74.33,22.11 74.2,22.23 70.9,22.23 70.77,22.11 70.77,17.53 70.52,17.28
+5V on Top Layer: 87.41,33.79 87.16,33.54 87.16,32.52 87.41,32.27 89.7,32.27 89.95,32.52 89.95,33.54 89.7,33.79
+5V on Inner2: 68.49,17.41 68.23,17.66 68.23,34.04 68.49,34.3 89.57,34.3 89.82,34.04 89.82,32.52 89.57,32.27 88.68,32.27 88.43,32.65 71.28,32.65 70.39,31.76 70.39,17.66 70.14,17.41
+VCC on Top Layer: 55.85,27.95 55.72,28.07 54.84,28.07 54.71,27.95 54.71,26.93 54.58,26.8 49.82,26.8 49.56,26.55 49.56,25.28 49.44,25.15 48.55,25.15 48.42,25.03 48.42,23.88 48.55,23.76 50.45,23.76 50.58,23.88 50.58,25.53 50.71,25.66 51.85,25.66 51.98,25.53 51.98,23.88 52.1,23.76 52.87,23.76 52.99,23.88 52.99,25.28 53.25,25.53 55.72,25.53 55.85,25.66
-2.5V on Top Layer: 37.5,25.72 37.37,25.6 37.37,24.52 37.5,24.39 40.17,24.39 40.29,24.52 40.29,25.6 40.17,25.72
-2.5V on Top Layer: 33.44,32.65 33.31,32.52 33.31,31.76 33.44,31.63 35.85,31.63 35.98,31.76 35.98,32.52 35.85,32.65
-4.5V on Top Layer: 43.72,33.03 43.6,32.9 43.6,31.5 43.47,31.38 43.21,31.38 43.09,31.25 43.09,30.36 43.21,30.23 47.66,30.23 47.91,30.49 47.91,33.15 47.79,33.28 47.02,33.28 46.9,33.15 46.9,31.5 46.77,31.38 43.85,31.38 43.85,31.63 45.37,31.63 45.5,31.76 45.5,32.9 45.37,33.03
-VCC on Top Layer: 54.85,28.96 54.72,29.09 54.72,29.98 54.47,30.23 49.82,30.23 49.56,30.49 49.56,31.76 49.44,31.88 48.55,31.88 48.42,32.01 48.42,33.15 48.55,33.28 50.45,33.28 50.58,33.15 50.58,31.38 50.71,31.25 51.85,31.25 51.98,31.38 51.98,33.15 52.1,33.28 52.95,33.28 53.07,33.15 53.07,31.76 53.33,31.5 55.61,31.5 55.87,31.25 55.87,29.09 55.74,28.96
GND on Top Layer: 61.33,22.23 61.07,21.98 61.07,20.33 61.33,20.07 63.15,20.07 63.15,22.23
GND on Top Layer: 43.21,29.85 43.09,29.73 43.09,29.34 42.96,29.22 40.8,29.22 40.67,29.09 40.67,24.26 40.42,24.01 36.86,24.01 36.61,24.26 36.61,27.69 37.12,28.2 37.12,31.5 37.25,31.63 40.04,31.63 40.17,31.76 40.17,32.9 40.04,33.03 36.48,33.03 36.36,32.9 36.36,31.38 36.23,31.25 34.96,31.25 34.83,31.12 34.83,30.11 34.96,29.98 36.23,29.98 36.36,29.85 36.36,28.46 36.1,28.2 34.96,28.2 34.83,28.07 34.83,27.06 34.96,26.93 35.34,26.93 35.47,26.8 35.47,14.99 35.72,14.74 42.01,14.74 42.26,14.99 42.26,19.63 42.13,19.76 40.42,19.76 40.29,19.88 40.29,20.33 40.17,20.45 39.15,20.45 39.02,20.33 39.02,19.44 39.15,19.31 40.17,19.31 40.42,19.06 41.82,19.06 41.94,18.93 41.94,18.04 41.69,17.79 37.37,17.79 37.12,18.04 37.12,22.23 37.37,22.49 38.52,22.49 38.77,22.74 44.36,22.74 44.61,22.49 44.61,19.82 44.48,19.69 43.21,19.69 43.09,19.57 43.09,19.18 43.21,19.06 44.48,19.06 44.61,19.25 45.88,19.25 46.01,19.38 46.01,22.36 45.75,22.61 45.75,24.39 45.5,24.65 42.83,24.65 42.58,24.9 42.58,27 42.71,27.19 47.53,27.19 47.66,27.31 47.66,29.73 47.53,29.85
GND on Top Layer: 58.66,29.47 58.53,29.34 58.53,26.55 58.66,26.42 60.18,26.42 60.31,26.55 60.31,29.34 60.18,29.47
GND on Top Layer: 29.88,10.93 29.75,10.8 29.75,5.72 29.88,5.6 30.64,5.6 30.77,5.72 30.77,10.8 30.64,10.93
GND on Top Layer: 29.75,28.58 29.63,28.46 29.63,24.26 29.75,24.14 30.64,24.14 30.77,24.26 30.77,28.46 30.64,28.58
GND on Top Layer: 49.75,29.85 49.69,29.79 49.69,27.25 49.75,27.19 54.07,27.19 54.14,27.25 54.14,29.79 54.07,29.85
GND on Bottom Layer: 21.12,34.42 20.86,34.17 20.86,26.04 21.12,25.79 24.8,25.79 25.05,25.53 25.05,9.66 24.8,9.41 21.12,9.41 20.86,9.15 20.86,0.9 21.12,0.64 99.09,0.64 99.35,0.9 99.35,14.99 99.09,15.25 48.04,15.25 47.79,15.5 47.79,27.95 47.91,28.07 48.42,28.07 48.55,27.95 48.55,19.69 48.8,19.44 63.15,19.44 63.41,19.82 63.41,22.74 63.15,22.99 61.5,22.99 61.25,23.25 61.25,34.17 60.99,34.42 48.8,34.42 48.55,34.17 48.55,29.09 48.42,28.96 47.91,28.96 47.79,29.09 47.79,34.17 47.53,34.42
GND on Inner1: 21.12,34.42 20.86,34.17 20.86,26.04 21.12,25.79 24.8,25.79 25.05,25.53 25.05,9.66 24.8,9.41 21.12,9.41 20.86,9.15 20.86,0.9 21.12,0.64 99.09,0.64 99.35,0.9 99.35,14.99 99.09,15.25 48.04,15.25 47.79,15.5 47.79,27.95 47.91,28.07 48.42,28.07 48.55,27.95 48.55,19.69 48.8,19.44 63.15,19.44 63.41,19.82 63.41,22.74 63.15,22.99 61.5,22.99 61.25,23.25 61.25,34.17 60.99,34.42 48.8,34.42 48.55,34.17 48.55,29.09 48.42,28.96 47.91,28.96 47.79,29.09 47.79,34.17 47.53,34.42
PGND on Top Layer: 65.57,22.23 65.57,20.07 67.42,20.07 67.68,20.33 67.68,21.98 67.42,22.23
PGND on Top Layer: 71.15,21.98 71.03,21.85 71.03,17.53 71.28,17.28 74.46,17.28 74.58,17.41 74.58,18.42 74.46,18.55 72.81,18.55 72.55,18.8 72.55,20.45 72.42,20.58 71.92,20.58 71.79,20.71 71.79,21.85 71.66,21.98
PGND on Top Layer: 88.68,31.76 88.55,31.63 88.55,29.85 88.43,29.73 86.52,29.73 86.39,29.6 86.39,28.71 86.52,28.58 88.43,28.58 88.55,28.46 88.55,28.07 88.68,27.95 90.08,27.95 90.2,28.07 90.2,31.63 90.08,31.76
PGND on Top Layer: 68.61,31.5 68.36,31.25 68.36,30.61 68.61,30.36 70.65,30.36 70.9,30.61 70.9,31.25 70.65,31.5
PGND on Top Layer: 79.92,26.3 79.92,23.88 80.17,23.63 81.7,23.63 81.95,23.88 81.95,28.07 81.82,28.2 80.93,28.2 80.68,27.95 80.68,26.8 80.43,26.55 80.17,26.55
PGND on Bottom Layer: 99.09,34.42 99.35,34.17 99.35,17.41 99.09,17.15 87.12,17.14 65.57,17.15 65.31,17.41 65.31,22.74 65.57,22.99 67.85,22.99 68.11,23.25 68.11,34.17 68.36,34.42
PGND on Inner1: 99.09,34.42 99.35,34.17 99.35,17.41 99.09,17.15 87.12,17.14 65.57,17.15 65.31,17.41 65.31,22.74 65.57,22.99 67.85,22.99 68.11,23.25 68.11,34.17 68.36,34.42
BAT+ on Top Layer: 73.58,33.66 73.33,33.41 73.33,31.88 73.58,31.63 74.85,31.63 75.62,32.52 75.62,33.41 75.36,33.66
BAT+ on Top Layer: 82.71,25.79 82.46,25.53 82.46,23.88 82.71,23.63 84.87,23.63 85.12,23.88 85.12,25.66 84.74,25.79
BAT+ on Inner2: 85.76,32.14 85.51,32.39 73.44,32.39 73.19,32.14 73.19,30.87 73.44,30.61 82.08,30.61 82.33,30.36 82.33,23.76 82.58,23.5 85.51,23.5 85.76,23.76
BAT_CHRG on Top Layer: 79.41,29.47 79.16,29.22 79.16,27.82 79.28,27.69 80.3,27.69 80.43,27.82 80.43,29.22 80.17,29.47
$1N17 on Top Layer: 56.88,33.28 56.76,33.15 56.76,28.96 56.88,28.84 58.03,28.84 58.15,28.96 58.15,29.73 58.28,29.85 60.06,29.85 60.31,30.11 60.31,33.03 60.06,33.28
$1N18 on Top Layer: 53.58,24.9 53.45,24.77 53.45,23.88 53.58,23.76 56.12,23.76 56.25,23.88 56.25,24.77 56.12,24.9
$1N19 on Top Layer: 53.58,33.28 53.45,33.15 53.45,32.27 53.58,32.14 56.12,32.14 56.25,32.27 56.25,33.15 56.12,33.28
$1N35 on Top Layer: 75.74,32.14 75.23,31.63 75.23,30.23 75.36,30.11 76.25,30.11 76.38,30.23 76.38,31.38 76.5,31.5 78.41,31.5 78.54,31.38 78.54,30.23 78.66,30.11 79.55,30.11 79.68,30.23 79.68,31.88 79.43,32.14
$1N37 on Top Layer: 60.31,24.01 60.06,23.76 56.76,23.76 56.63,23.88 56.63,27.95 56.76,28.07 58.03,28.07 58.15,27.95 58.15,25.66 58.41,25.41 60.18,25.41 60.31,25.28
$1N50 on Top Layer: 69.25,27.44 69.12,27.31 69.12,26.55 69.25,26.42 71.92,26.42 72.04,26.3 72.04,23.19 72.11,23.12 72.68,23.12 72.81,23.25 72.81,27.31 72.68,27.44
$1N51 on Top Layer: 70.71,23.12 69.25,23.12 69.12,23.25 69.12,25.41 69.25,25.53 70.65,25.53 70.77,25.41 70.77,23.19
$1N66 on Top Layer: 46.52,19.12 46.39,18.99 44.74,18.99 44.61,18.8 43.09,18.8 42.96,18.68 42.96,18.17 43.09,18.04 47.41,18.04 47.53,18.17 47.53,18.99 47.41,19.12
$1N70 on Top Layer: 37.5,19.06 37.37,18.93 37.37,18.17 37.5,18.04 41.56,18.04 41.69,18.17 41.69,18.68 41.56,18.8 40.29,18.8 40.04,19.06
$1N78 on Top Layer: 40.67,33.03 40.55,32.9 40.55,29.6 40.67,29.47 42.33,29.47 42.45,29.6 42.45,31.63 42.33,31.76 41.44,31.76 41.44,31.88 43.09,31.88 43.21,32.01 43.21,32.9 43.09,33.03
$1N80 on Top Layer: 39.02,29.22 38.9,29.09 38.9,27.06 38.77,26.93 37.5,26.93 37.37,26.8 37.37,26.11 37.44,25.98 40.17,25.98 40.29,26.11 40.29,29.09 40.17,29.22

Small or netless copper shapes (teardrops, artwork), in the pictures only: 6 on Top Layer

## Text on the board
Bottom Silkscreen Layer: 2024-05-15 | By AISS | SGM8061 | 高压差分探头
Top Silkscreen Layer: 50X | 500X | By AISS | - | +
